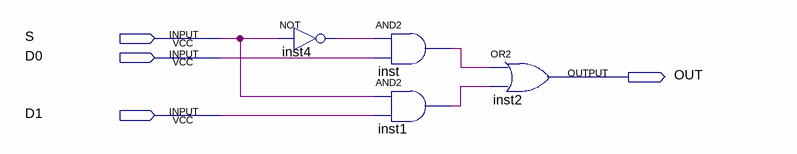
[diagram p0: schematic sheet]
// Quartus schematic Mux2_1Bit.bdf as structural Verilog: 4 symbols, 4 pins
module Mux2_1Bit (
  input  S,
  input  D0,
  input  D1,
  output OUT
);

  wire inst1_out, inst4_out, inst_out;

  not inst4 (inst4_out, S);
  and inst (inst_out, inst4_out, D0);
  and inst1 (inst1_out, S, D1);
  or inst2 (OUT, inst_out, inst1_out);
endmodule
